# Altium schematic sheet [3] - USB.SchDoc: Control Board
size A4; CheckedBy: Rafael Lang; CompanyName: Gear Labs; DrawnBy: Pedro Neves; Organization: Gear Labs; DocumentNumber: 001/2017; Revision: v1.0; SheetNumber: 3; SheetTotal: 6
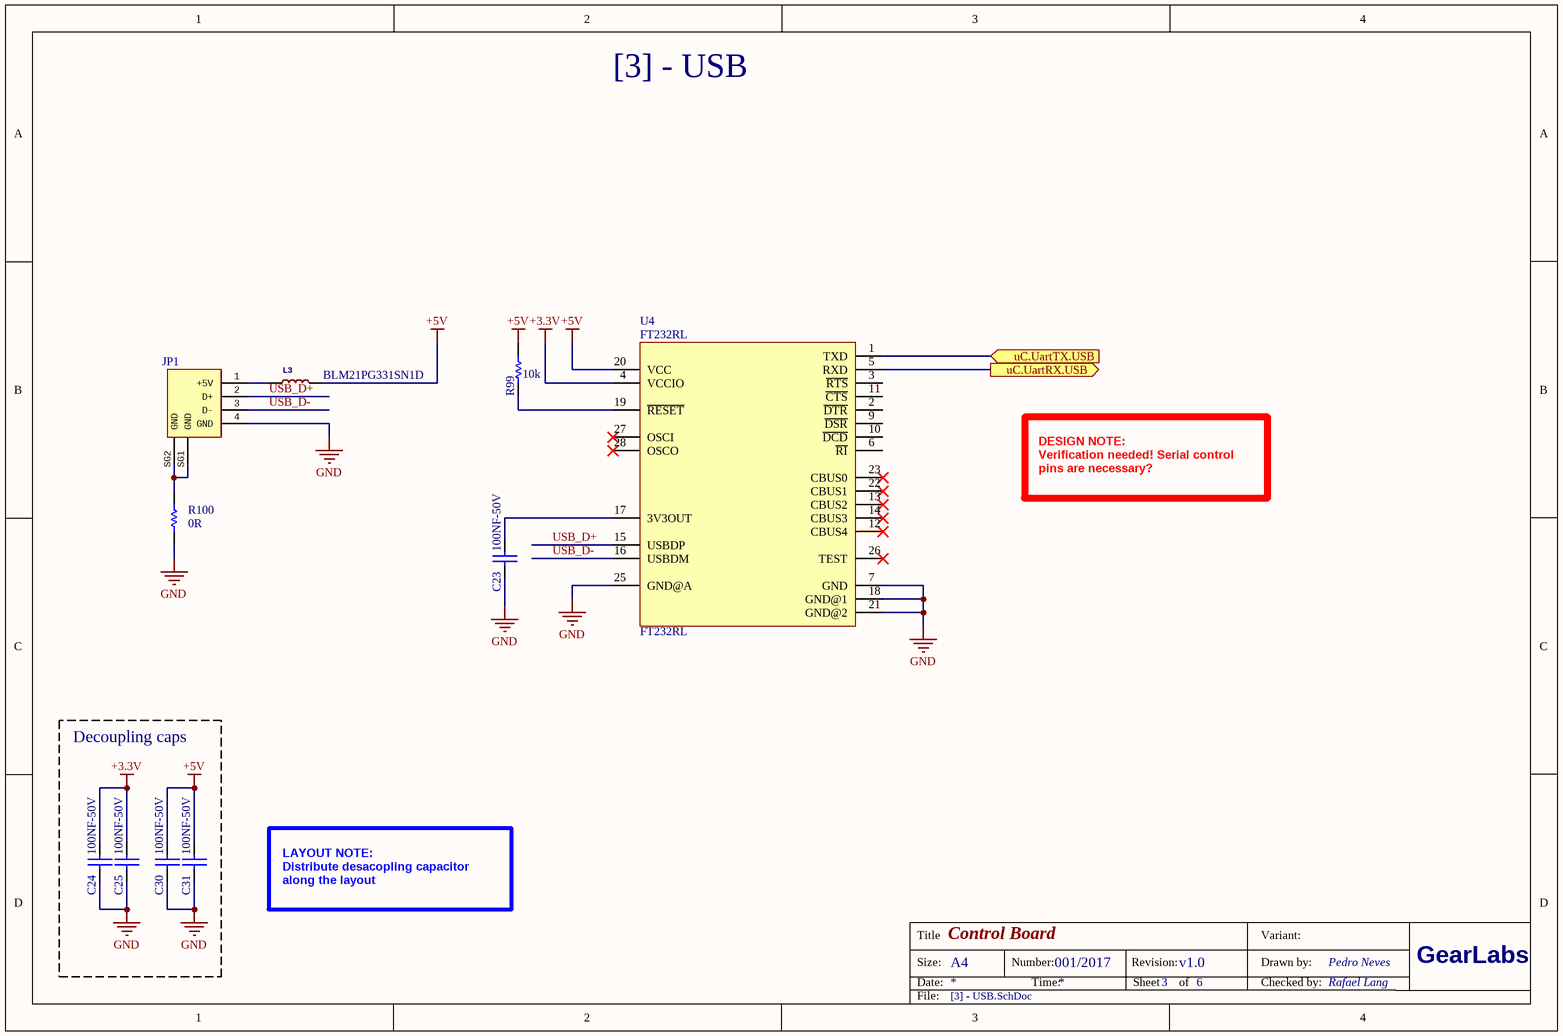
[diagram p0: [3] - USB.SchDoc]

## Parts
C23  value 100NF-50V  [C0603]  (hidden comment: 302010138)
C24  value 100NF-50V  [C0603]  (hidden comment: 302010138)
C25  value 100NF-50V  [C0603]  (hidden comment: 302010138)
C30  value 100NF-50V  [C0603]  (hidden comment: 302010138)
C31  value 100NF-50V  [C0603]  (hidden comment: 302010138)
JP1  320010007  [USB4+2P-2.0-90D]  (value not drawn)
L3  MPN: BLM21PG331SN1D  [L0805]  (hidden comment: 303030006)
R99  value 10k  [R0603]  (hidden comment: 301010293)
R100  value 0R  [R0603]  (hidden comment: 301010292)
U4  FT232RL  [SSOP28-0.65-10.2X5.2MM]

## Blocks framed on the sheet
Decoupling caps: C24 C25 C30 C31

## Ports
uC.UartRX.USB (out), uC.UartTX.USB (in)

## Nets
+3.3V: C24.1 C25.1 U4.4(VCCIO)
+5V: C30.1 C31.1 L3.2 R99.2 U4.20(VCC)
GND: C23.2 C24.2 C25.2 C30.2 C31.2 JP1.4(GND) R100.1 U4.7(GND) U4.18(GND@1) U4.21(GND@2) U4.25(GND@A)
uC.UartRX.USB: U4.5(RXD) ; port uC.UartRX.USB
uC.UartTX.USB: U4.1(TXD) ; port uC.UartTX.USB
USB_D+: JP1.2(D+) U4.15(USBDP)
USB_D-: JP1.3(D-) U4.16(USBDM)
NetC23_1: C23.1 U4.17(3V3OUT)
NetJP1_1: JP1.1(+5V) L3.1
NetJP1_SG1: JP1.SG1(GND) JP1.SG2(GND) R100.2
NetR99_1: R99.1 U4.19(~{RESET})

Not connected (* = marked no-connect by the designer): U4 2(~{DTR}) 3(~{RTS}) 6(~{RI}) 9(~{DSR}) 10(~{DCD}) 11(~{CTS}) 12(CBUS4)* 13(CBUS2)* 14(CBUS3)* 22(CBUS1)* 23(CBUS0)* 26(TEST)* 27(OSCI)* 28(OSCO)*

## Notes on the sheet
- [3] - USB
- DESIGN NOTE:
  Verification needed! Serial control pins are necessary?
- LAYOUT NOTE:
  Distribute desacopling capacitor along the layout
- Title
- Size:
- Date:
- A4
- Number:
- Time:
- Revision:
- Sheet
- of
- Drawn by:
- Checked by:
- Variant:
- GearLabs
- File:

## Library data of the parts
C23-C25 C30 C31 = CERAMIC-100NF-50V-10%-X7R(0603): MPN: CC0603KRX7R9BB104
JP1 = DIP-USB-A-TYPE-FMAL(4+2P-2.0-90D)
L3 = SMD-FERRITE-BEAD-330R-1500MA(0805)'0805'
R99 = SMD-RES-10K-5%-1/10W(0603): MPN: RC0603JR-0710KL
R100 = SMD-RES-0R-5%-1/10W(0603): MPN: RC0603JR-070RL
U4 = INTERFACE-FT232RL(SSOP28): MPN: FT232RL